# Altium schematic sheet 寻的小车.SchDoc
size A3
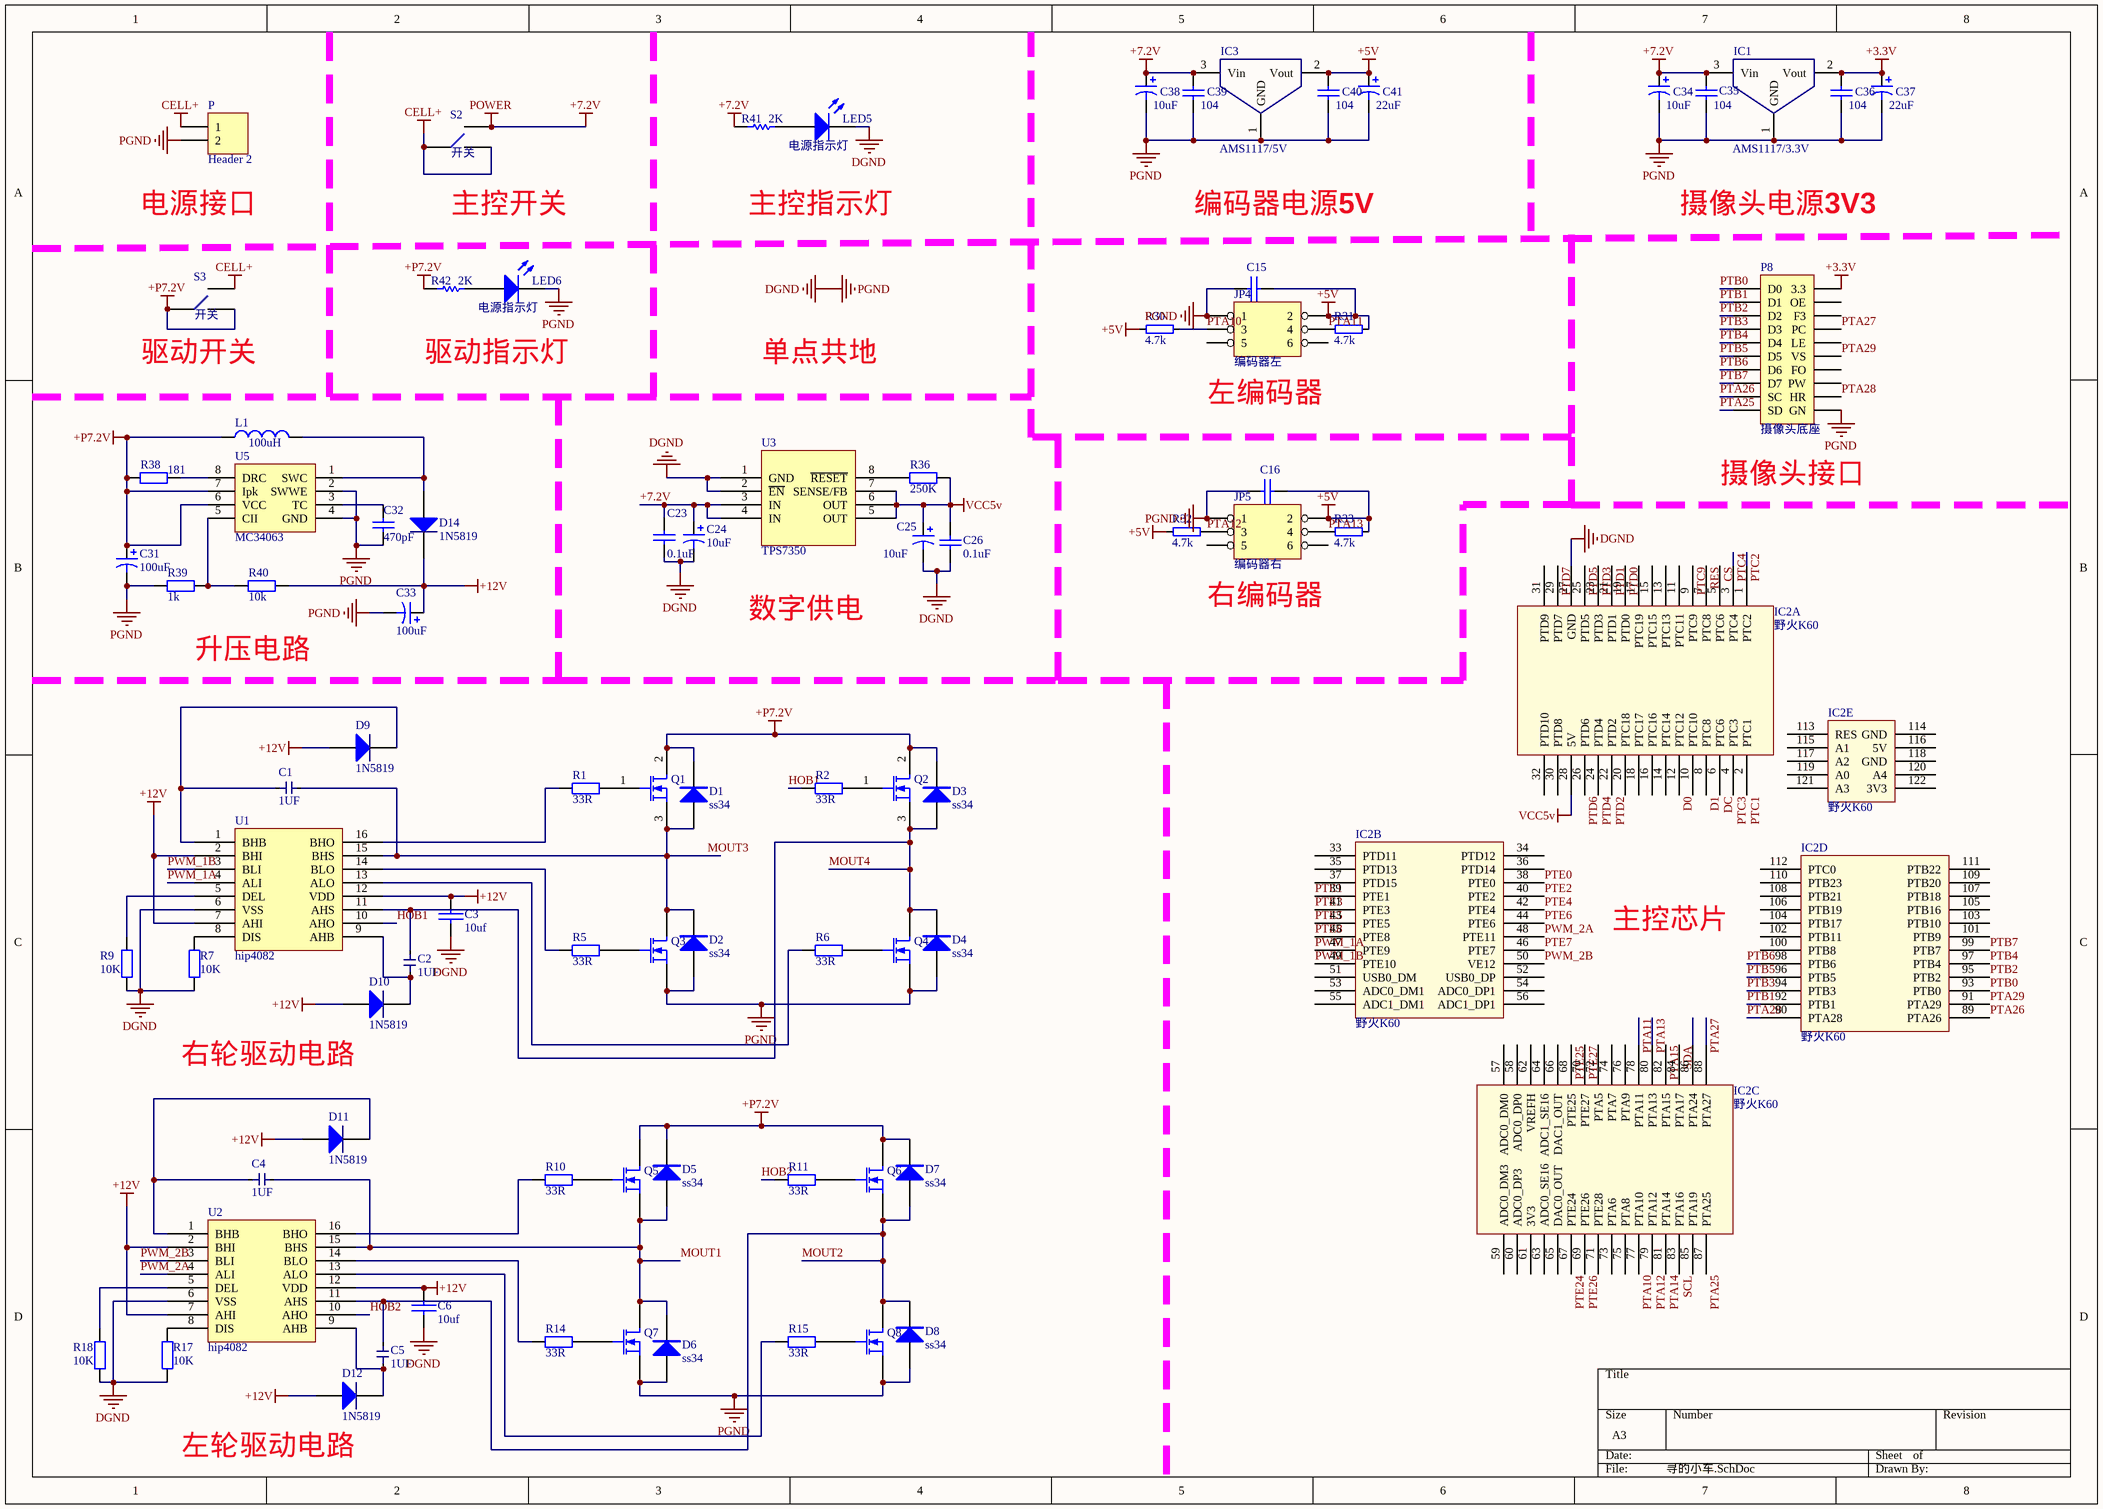
[diagram p0: 寻的小车.SchDoc]

## Parts
C1  1UF  [0805]
C2  1UF  [0805]
C3  10uf  [0805]
C4  1UF  [0805]
C5  1UF  [0805]
C6  10uf  [0805]
C15  104  [R0603]
C16  104  [R0603]
C23  value 0.1uF  [R0603]  (hidden comment: CAPACITY)
C24  value 10uF  [0805]  (hidden comment: Cap Pol3)
C25  value 10uF  [1206C]  (hidden comment: CAP  Pol)
C26  value 0.1uF  [R0603]  (hidden comment: CAPACITY)
C31  value 100uF  [10UF]  (hidden comment: CAP  Pol)
C32  value 470pF  [0805小贴片]  (hidden comment: CAPACITY)
C33  value 100uF  [2512]  (hidden comment: CAP  Pol)
C34  value 10uF  [0805]  (hidden comment: Cap Pol1)
C35  value 104  [CAP_0805]  (hidden comment: Cap)
C36  value 104  [CAP_0805]  (hidden comment: Cap)
C37  value 22uF  [1206C]  (hidden comment: Cap Pol1)
C38  value 10uF  [0805]  (hidden comment: Cap Pol1)
C39  value 104  [CAP_0805]  (hidden comment: Cap)
C40  value 104  [CAP_0805]  (hidden comment: Cap)
C41  value 22uF  [1206C]  (hidden comment: Cap Pol1)
D1  ss34  [SS14]
D2  ss34  [SS14]
D3  ss34  [SS14]
D4  ss34  [SS14]
D5  ss34  [SS14]
D6  ss34  [SS14]
D7  ss34  [SS14]
D8  ss34  [SS14]
D9  1N5819  [SS14]
D10  1N5819  [SS14]
D11  1N5819  [SS14]
D12  1N5819  [SS14]
D14  1N5819  [SS14]
IC1  AMS1117/3.3V  [SOT_223]
IC2  野火K60  [mk60FN]  (parts A,B,C,D,E of 5)
IC3  AMS1117/5V  [SOT_223]
JP4  编码器左  [HDR2X3]
JP5  编码器右  [HDR2X3]
L1  value 100uH  [小贴片电感]  (hidden comment: Inductor)
LED5  电源指示灯  [0603D]
LED6  电源指示灯  [0603D]
P  Header 2  [T(G)]
P8  摄像头底座  [摄像头座]
Q1  (no value)  [NMOS]
Q2  IRF3205  [NMOS]  (value not drawn)
Q3  IRF3205  [NMOS]  (value not drawn)
Q4  IRF3205  [NMOS]  (value not drawn)
Q5  IRF3205  [NMOS]  (value not drawn)
Q6  IRF3205  [NMOS]  (value not drawn)
Q7  IRF3205  [NMOS]  (value not drawn)
Q8  IRF3205  [NMOS]  (value not drawn)
R1  value 33R  [0805]  (hidden comment: RES2_0805)
R2  value 33R  [0805]  (hidden comment: RES2_0805)
R5  value 33R  [0805]  (hidden comment: RES2_0805)
R6  value 33R  [0805]  (hidden comment: RES2_0805)
R7  value 10K  [R0603]  (hidden comment: RES2_0805)
R9  value 10K  [R0603]  (hidden comment: RES2_0603)
R10  value 33R  [0805]  (hidden comment: RES2_0805)
R11  value 33R  [0805]  (hidden comment: RES2_0805)
R14  value 33R  [0805]  (hidden comment: RES2_0805)
R15  value 33R  [0805]  (hidden comment: RES2_0805)
R17  value 10K  [R0603]  (hidden comment: RES2_0805)
R18  value 10K  [R0603]  (hidden comment: RES2_0603)
R30  4.7k  [R0603]
R31  4.7k  [R0603]
R32  4.7k  [R0603]
R33  4.7k  [R0603]
R36  value 250K  [0805]  (hidden comment: RES2_0805)
R38  value 181  [R0603]  (hidden comment: RES2_0805)
R39  value 1k  [R0603]  (hidden comment: RES2_0805)
R40  value 10k  [R0603]  (hidden comment: RES2_0805)
R41  value 2K  [RES_0805]  (hidden comment: Res1)
R42  value 2K  [RES_0805]  (hidden comment: Res1)
S2  开关  [扭头开关]
S3  开关  [扭头开关]
U1  hip4082  [SO16NB]
U2  hip4082  [SO16NB]
U3  TPS7350  [SOP_8]
U5  MC34063  [SO8]

## Nets
+3.3V: C36.2 C37.1 IC1.2(Vout) P8.2(3.3)
+5V: C15.2 C16.2 C40.2 C41.1 IC3.2(Vout) JP4.2 JP5.2 R30.1 R31.2 R32.1 R33.2
+7.2V: C23.2 C24.1 C34.1 C35.2 C38.1 C39.2 IC1.3(Vin) IC3.3(Vin) R41.2 S2.2 U3.3(IN) U3.4(IN)  [also labelled POWER]
+12V: C3.1 C6.1 C33.1 D9.1(A) D10.1(A) D11.1(A) D12.1(A) D14.2(K) R40.1 U1.2(BHI) U1.7(AHI) U1.12(VDD) U2.2(BHI) U2.7(AHI) U2.12(VDD)
+P7.2V: C31.1 D1.K D3.K D5.K D7.K L1.1 Q1.2(D) Q2.2(D) Q5.2(D) Q6.2(D) R38.1 R42.2 S3.1 S3.3 U5.6(VCC) U5.7(Ipk)
CELL+: P.1 S2.1 S2.3 S3.2
DGND: C3.2 C6.2 C15.1 C16.1 C23.1 C24.2 C25.2 C26.1 C31.2 C32.1 C33.2 C34.2 C35.1 C36.1 C37.2 C38.2 C39.1 C40.1 C41.2 D2.A D4.A D6.A D8.A IC1.1(GND) IC2.27(GND) IC3.1(GND) JP4.1 JP5.1 LED5.2(K) LED6.2(K) P.2 P8.20(GN) Q3.3(S) Q4.3(S) Q7.3(S) Q8.3(S) R7.1 R9.2 R17.1 R18.2 R39.1 U1.6(VSS) U2.6(VSS) U3.1(GND) U3.2(~{EN}) U5.2(SWWE) U5.4(GND)  [also labelled PGND]
VCC5v: C25.1 C26.2 IC2.28(5V) R36.2 U3.5(OUT) U3.6(OUT) U3.7(SENSE/FB)
CS: IC2.5(PTC6)
D0: IC2.12(PTC12)
D1: IC2.8(PTC8)
DC: IC2.6(PTC6)
HOB1: R2.1 U1.10(AHO)
HOB2: R11.1 U2.10(AHO)
MOUT1: C4.18 D5.A D6.K Q5.3(S) Q7.2(D) U2.15(BHS)
MOUT2: C5.18 D7.A D8.K Q6.3(S) Q8.2(D) U2.11(AHS)
MOUT3: C1.18 D1.A D2.K Q1.3(S) Q3.2(D) U1.15(BHS)
MOUT4: C2.18 D3.A D4.K Q2.3(S) Q4.2(D) U1.11(AHS)
PTA10: IC2.77(PTA10) JP4.3 R30.2
PTA11: IC2.78(PTA11) JP4.4 R31.1
PTA12: IC2.79(PTA12) JP5.3 R32.2
PTA13: IC2.80(PTA13) JP5.4 R33.1
PTA14: IC2.81(PTA14)
PTA15: IC2.82(PTA15)
PTA25: IC2.87(PTA25) P8.19(SD)
PTA26: IC2.89(PTA26) P8.17(SC)
PTA27: IC2.88(PTA27) P8.8(PC)
PTA28: IC2.90(PTA28) P8.18(HR)
PTA29: IC2.91(PTA29) P8.12(VS)
PTB0: IC2.93(PTB0) P8.1(D0)
PTB1: IC2.92(PTB1) P8.3(D1)
PTB2: IC2.95(PTB2) P8.5(D2)
PTB3: IC2.94(PTB3) P8.7(D3)
PTB4: IC2.97(PTB4) P8.9(D4)
PTB5: IC2.96(PTB5) P8.11(D5)
PTB6: IC2.98(PTB6) P8.13(D6)
PTB7: IC2.99(PTB7) P8.15(D7)
PTC1: IC2.2(PTC1)
PTC2: IC2.1(PTC2)
PTC3: IC2.4(PTC3)
PTC4: IC2.3(PTC4)
PTC9: IC2.9(PTC9)
PTD0: IC2.19(PTD0)
PTD1: IC2.21(PTD1)
PTD2: IC2.22(PTD2)
PTD3: IC2.23(PTD3)
PTD4: IC2.24(PTD4)
PTD5: IC2.25(PTD5)
PTD6: IC2.26(PTD6)
PTD7: IC2.29(PTD7)
PTE0: IC2.38(PTE0)
PTE1: IC2.39(PTE1)
PTE2: IC2.40(PTE2)
PTE3: IC2.41(PTE3)
PTE4: IC2.42(PTE4)
PTE5: IC2.43(PTE5)
PTE6: IC2.44(PTE6)
PTE7: IC2.46(PTE7)
PTE8: IC2.45(PTE8)
PTE24: IC2.67(PTE24)
PTE25: IC2.68(PTE25)
PTE26: IC2.69(PTE26)
PTE27: IC2.70(PTE27)
PWM_1A: IC2.47(PTE9) U1.4(ALI)
PWM_1B: IC2.49(PTE10) U1.3(BLI)
PWM_2A: IC2.48(PTE11) U2.4(ALI)
PWM_2B: IC2.50(VE12) U2.3(BLI)
RES: IC2.7(PTC8)
SCL: IC2.83(PTA16)
SDA: IC2.84(PTA17)
NetC1_17: C1.17 D9.2(K) U1.1(BHB)
NetC2_17: C2.17 D10.2(K) U1.9(AHB)
NetC4_17: C4.17 D11.2(K) U2.1(BHB)
NetC5_17: C5.17 D12.2(K) U2.9(AHB)
NetC32_2: C32.2 U5.3(TC)
NetD14_1: D14.1(A) L1.2 U5.1(SWC)
NetLED5_1: LED5.1(A) R41.1
NetLED6_1: LED6.1(A) R42.1
NetQ1_1: Q1.1(G) R1.2
NetQ2_1: Q2.1(G) R2.2
NetQ3_1: Q3.1(G) R5.2
NetQ4_1: Q4.1(G) R6.2
NetQ5_1: Q5.1(G) R10.2
NetQ6_1: Q6.1(G) R11.2
NetQ7_1: Q7.1(G) R14.2
NetQ8_1: Q8.1(G) R15.2
NetR1_1: R1.1 U1.16(BHO)
NetR5_1: R5.1 U1.14(BLO)
NetR6_1: R6.1 U1.13(ALO)
NetR7_2: R7.2 U1.8(DIS)
NetR9_1: R9.1 U1.5(DEL)
NetR10_1: R10.1 U2.16(BHO)
NetR14_1: R14.1 U2.14(BLO)
NetR15_1: R15.1 U2.13(ALO)
NetR17_2: R17.2 U2.8(DIS)
NetR18_1: R18.1 U2.5(DEL)
NetR36_1: R36.1 U3.8(~{RESET})
NetR38_2: R38.2 U5.8(DRC)
NetR39_2: R39.2 R40.2 U5.5(CII)

Not connected (* = marked no-connect by the designer): IC2 10(PTC10) 11(PTC11) 13(PTC13) 14(PTC14) 15(PTC15) 16(PTC16) 17(PTC19) 18(PTC17) 20(PTC18) 30(PTD8) 31(PTD9) 32(PTD10) 33(PTD11) 34(PTD12) 35(PTD13) 36(PTD14) 37(PTD15) 51(USB0_DM) 52(USB0_DP) 53(ADC0_DM1) 54(ADC0_DP1) 55(ADC1_DM1) 56(ADC1_DP1) 57(ADC0_DM0) 58(ADC0_DP0) 59(ADC0_DM3) 60(ADC0_DP3) 61(3V3) 62(VREFH) 63(ADC0_SE16) 64(ADC1_SE16) 65(DAC0_OUT) 66(DAC1_OUT) 71(PTE28) 72(PTA5) 73(PTA6) 74(PTA7) 75(PTA8) 76(PTA9) 85(PTA19) 86(PTA24) 100(PTB8) 101(PTB9) 102(PTB11) 103(PTB10) 104(PTB17) 105(PTB16) 106(PTB19) 107(PTB18) 108(PTB21) 109(PTB20) 110(PTB23) 111(PTB22) 112(PTC0) 113(RES) 114(GND) 115(A1) 116(5V) 117(A2) 118(GND) 119(A0) 120(A4) 121(A3) 122(3V3); JP4 5 6; JP5 5 6; P8 4(OE) 6(F3) 10(LE) 14(FO) 16(PW)

## Notes on the sheet
- 电源接口
- (near S2) 主控开关
- 主控指示灯
- 编码器电源5V
- 摄像头电源3V3
- (near S3) 驱动开关
- 驱动指示灯
- 单点共地
- (near JP4) 左编码器
- (near P8) 摄像头接口
- 数字供电
- 右编码器
- 升压电路
- 主控芯片
- 右轮驱动电路
- 左轮驱动电路

## Library data of the parts
C1 C2 C4 C5 = 电容: pin to pad: 17>1 18>2
C3 C6 C15 C16 = 普通电容: Capacitor
C23 C26 = CAP_0603
C24 = Cap Pol3: Polarized Capacitor (Surface Mount); Published: 8-Jun-2000; LatestRevisionDate: 17-Jul-2002; LatestRevisionNote: Re-released for DXP Platform.; PackageReference: C0805; Publisher: Altium Limited
C32 = CAP_0805
C34 C37 C38 C41 = Cap Pol1: Polarized Capacitor (Radial); Published: 8-Jun-2000; LatestRevisionDate: 17-Jul-2002; LatestRevisionNote: Re-released for DXP Platform.; PackageReference: RB7.6-15; Publisher: Altium Limited; PackageDescription: Polarized Capacitor (Radial); 2 Leads
C35 C36 C39 C40 = Cap: Capacitor; Published: 8-Jun-2000; LatestRevisionDate: 17-Jul-2002; LatestRevisionNote: Re-released for DXP Platform.; PackageReference: RAD-0.3; Publisher: Altium Limited; PackageDescription: Radial Cap, Thru-Hole; 2 Leads; 0.3 in Pin Spacing
D1-D8 = DIODE: pin to pad: A>1 K>2
D9-D12 = 1N5819: pin to pad: A>1 K>2
IC1 IC3 = AMS1117
JP4 JP5 = HEADER 3X2
L1 = Inductor: Code_IEC: 1005; Published: 8-Jun-2000; LatestRevisionDate: 17-Jul-2002; LatestRevisionNote: Re-released for DXP Platform.; PackageReference: 0402-A; Publisher: Altium Limited; Code_JEITA: 0402
LED5 LED6 = LED0: Typical INFRARED GaAs LED; Published: 8-Jun-2000; LatestRevisionDate: 08-Jul-2005; LatestRevisionNote: Mech Layer 1 removed.; PackageReference: LED-0; Publisher: Altium Limited; PackageDescription: LED; 2 Leads
P = Header 2: Header, 2-Pin; LatestRevisionDate: 17-Jul-2002; LatestRevisionNote: Re-released for DXP Platform.; Publisher: Altium Limited
P8 = Header 10X2H: Header, 10-Pin, Dual row, Right Angle; LatestRevisionDate: 17-Jul-2002; LatestRevisionNote: Re-released for DXP Platform.; Publisher: Altium Limited
Q1-Q8 = MOSFET-N: N-Channel MOSFET; PackageDocument: 1995/1996; Published: 8-Jun-2000; LatestRevisionDate: 17-Jul-2002; LatestRevisionNote: Re-released for DXP Platform.; PackageReference: E3; Publisher: Altium Limited
R30-R33 = RES
R41 R42 = Res1: Resistor; Published: 8-Jun-2000; LatestRevisionDate: 17-Jul-2002; LatestRevisionNote: Re-released for DXP Platform.; PackageReference: AXIAL-0.3; Publisher: Altium Limited; PackageDescription: Axial Device, Thru-Hole; 2 Leads; 0.3 in Pin Spacing
S2 S3 = slide_switch
U3 = TPS7350: This is a power comnonet